# EAGLE schematic ext_tuner_rev1 (EAGLE 7.6.0)

## Sheet 1 of 4
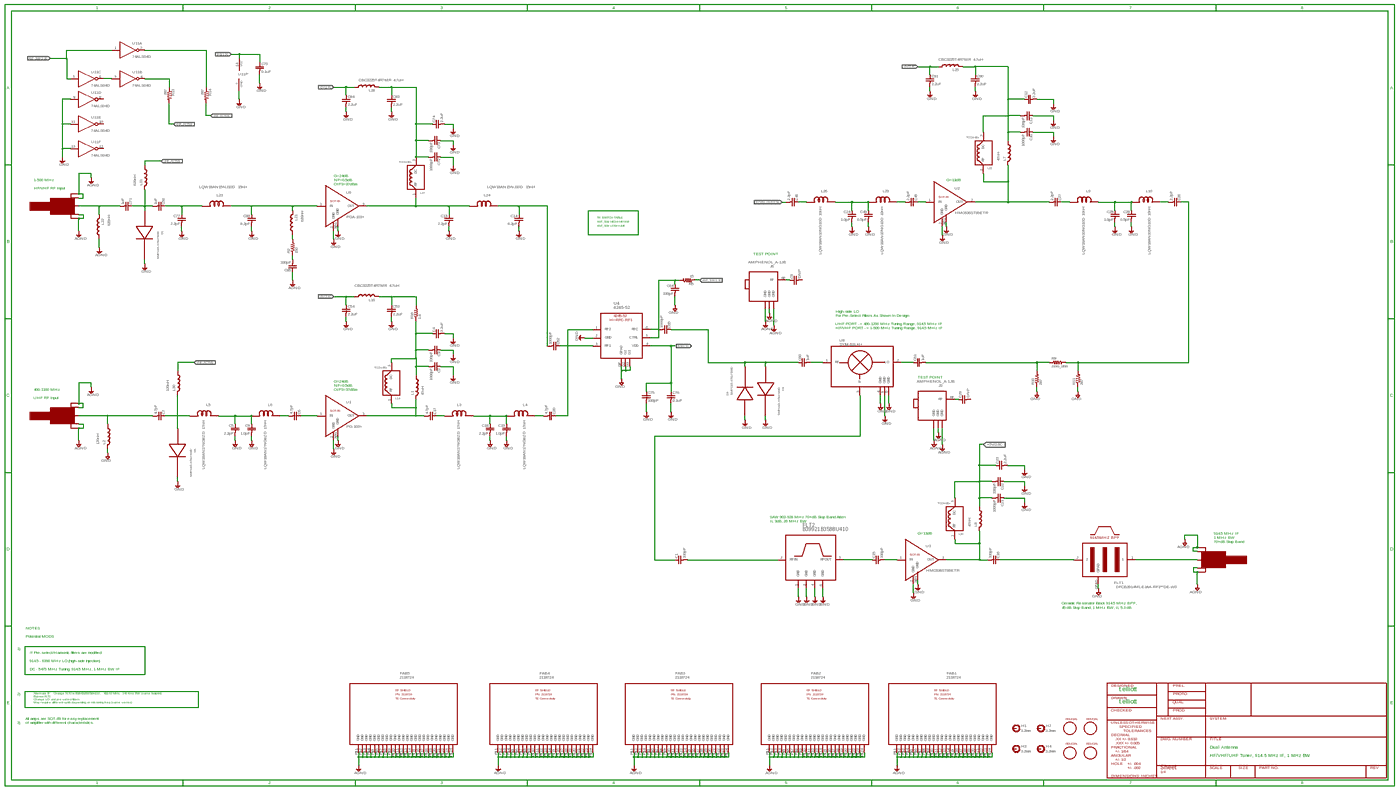
[diagram p0: schematic, sheet 1, overview]
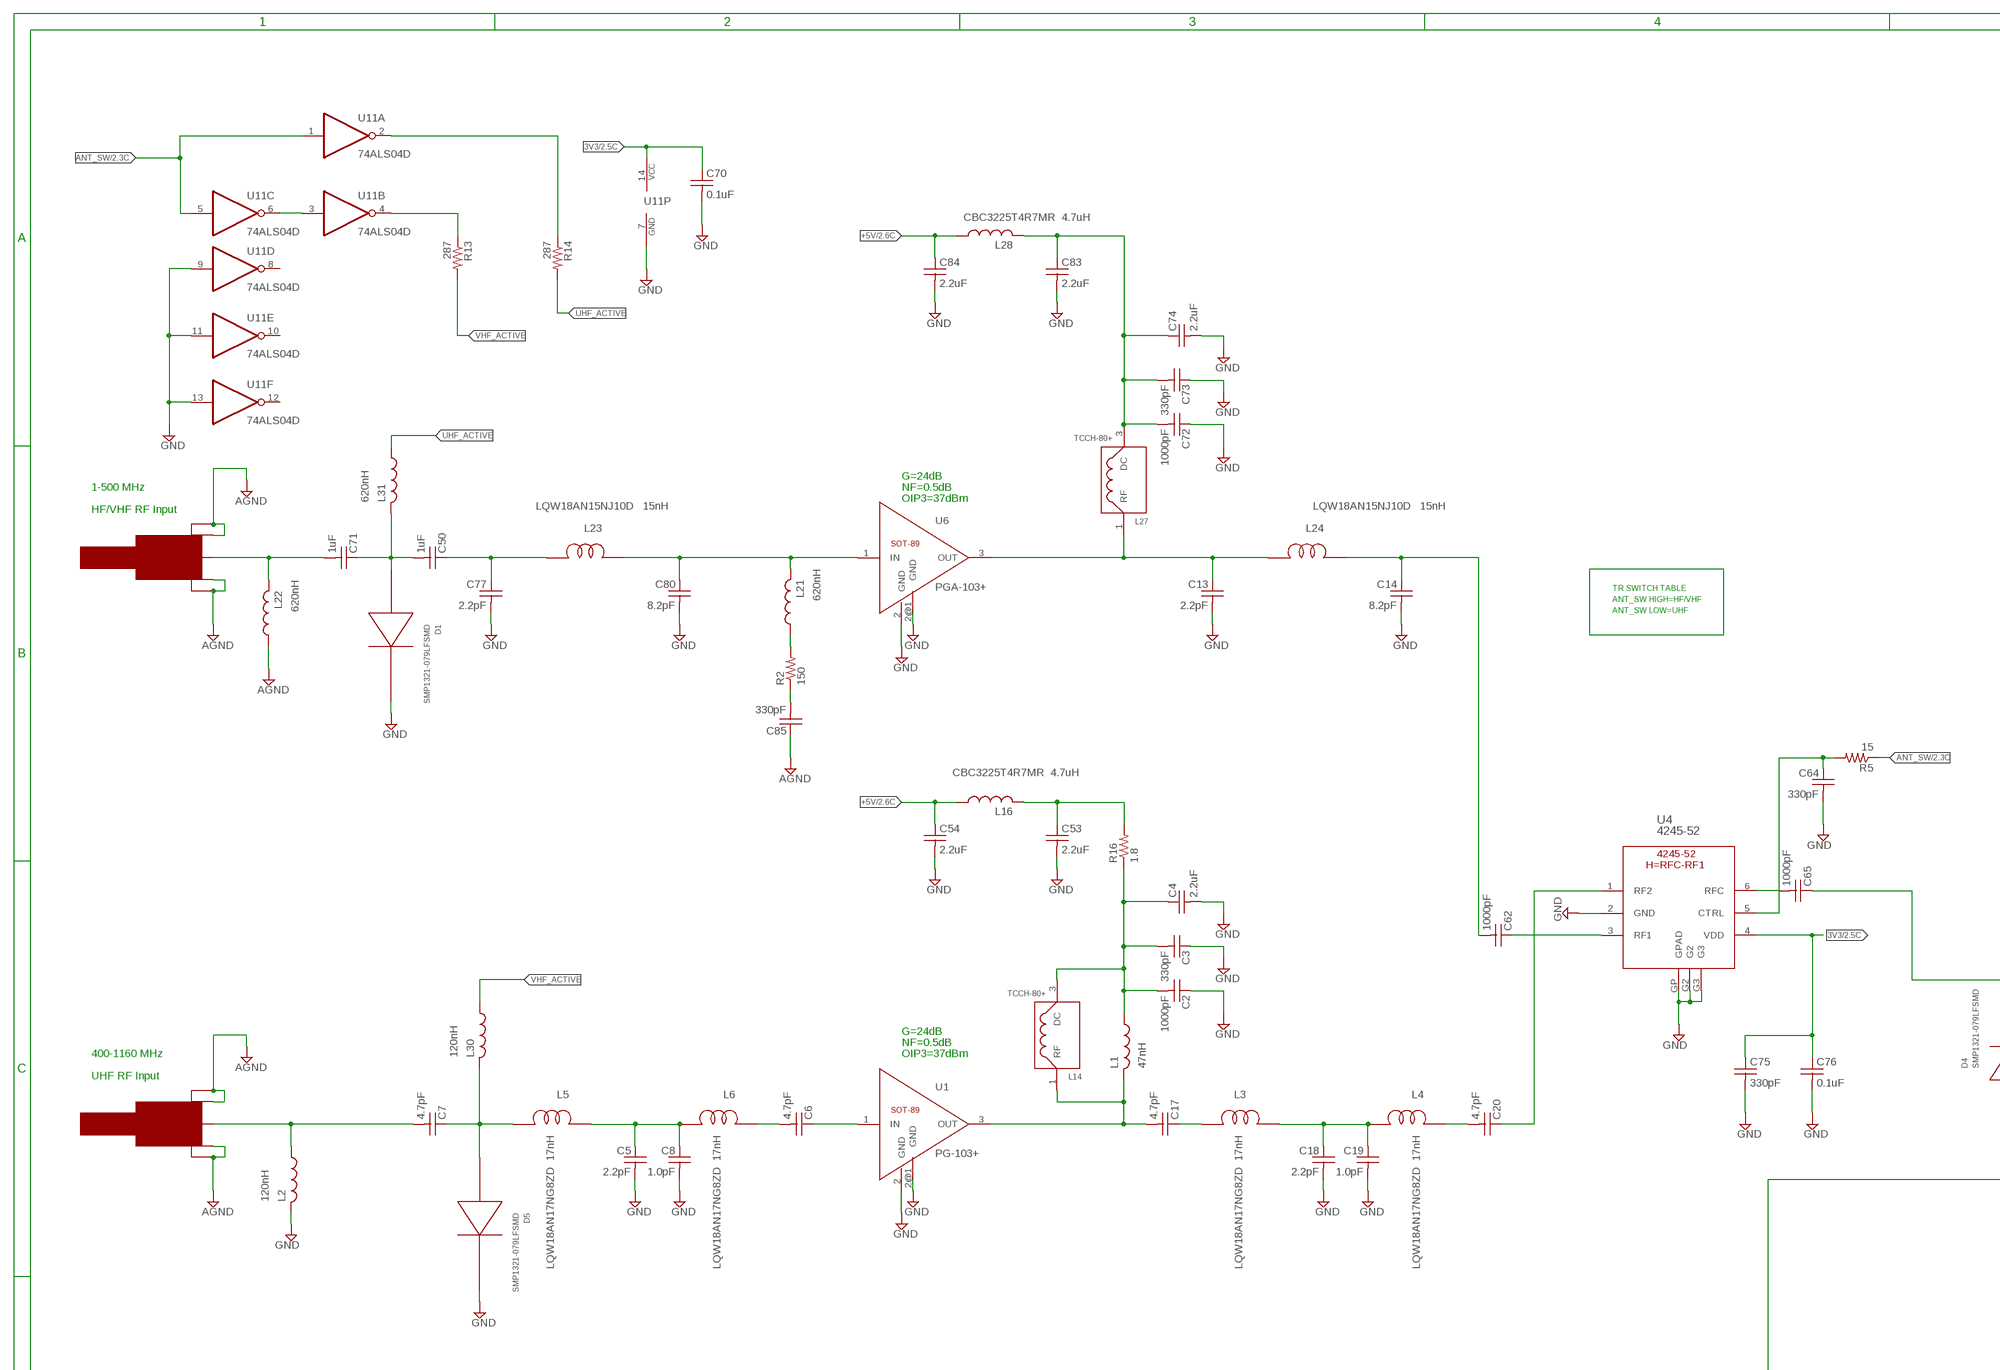
[diagram p1: schematic, sheet 1, part 1 of 4]
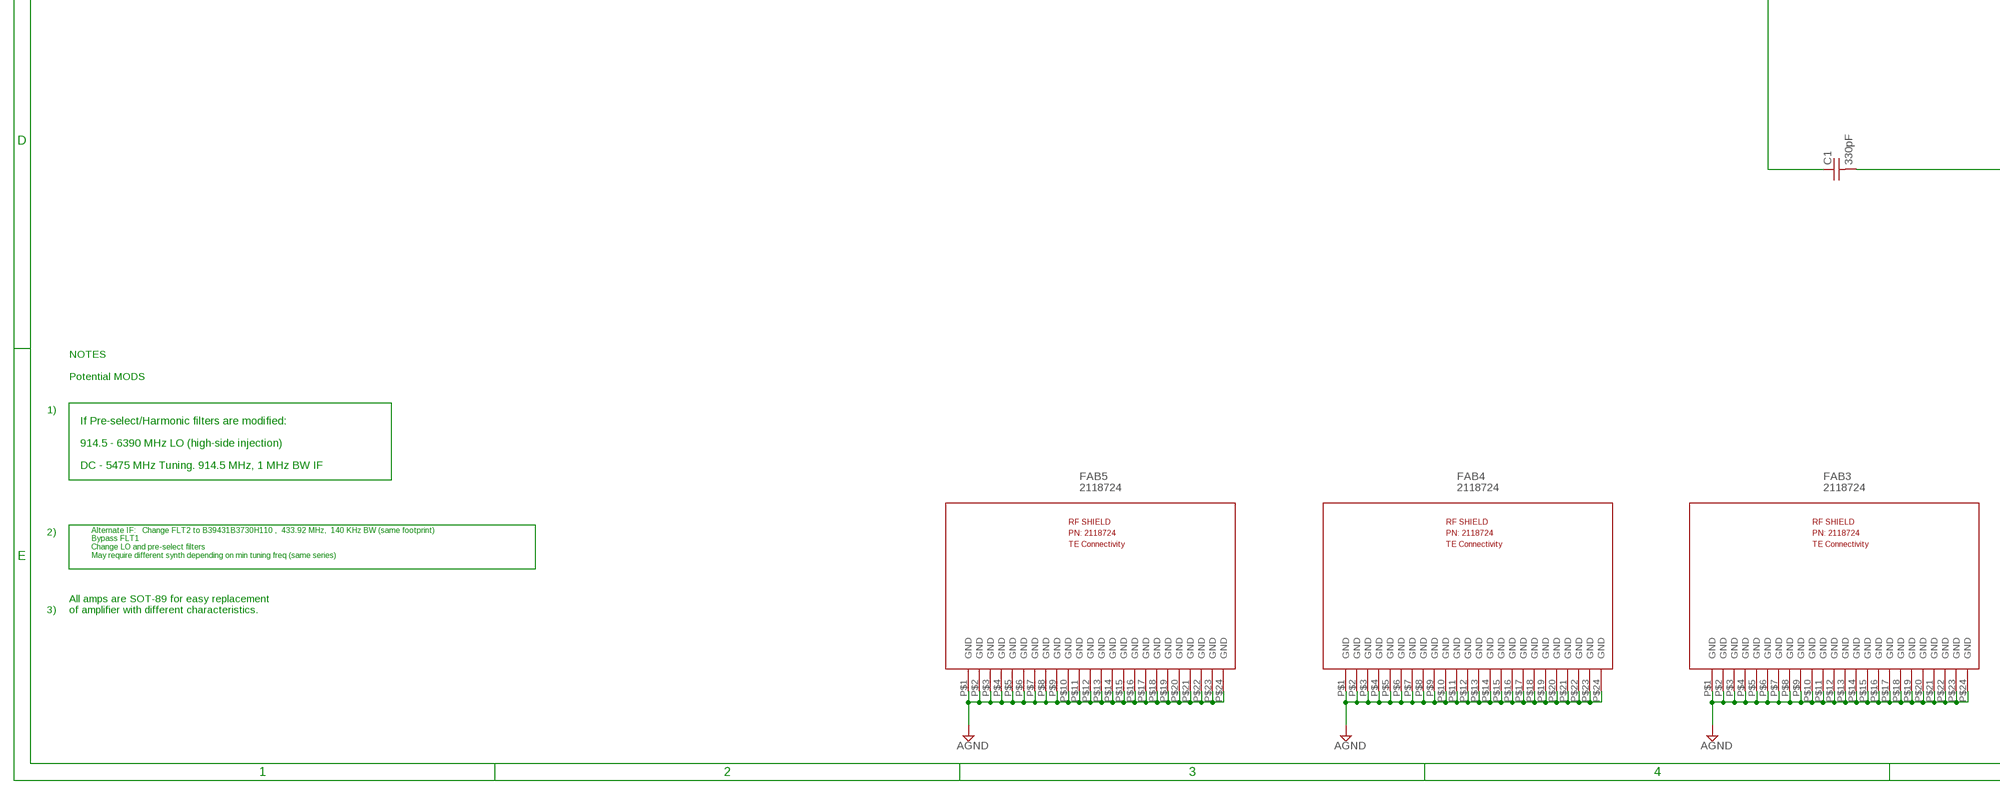
[diagram p2: schematic, sheet 1, part 2 of 4]
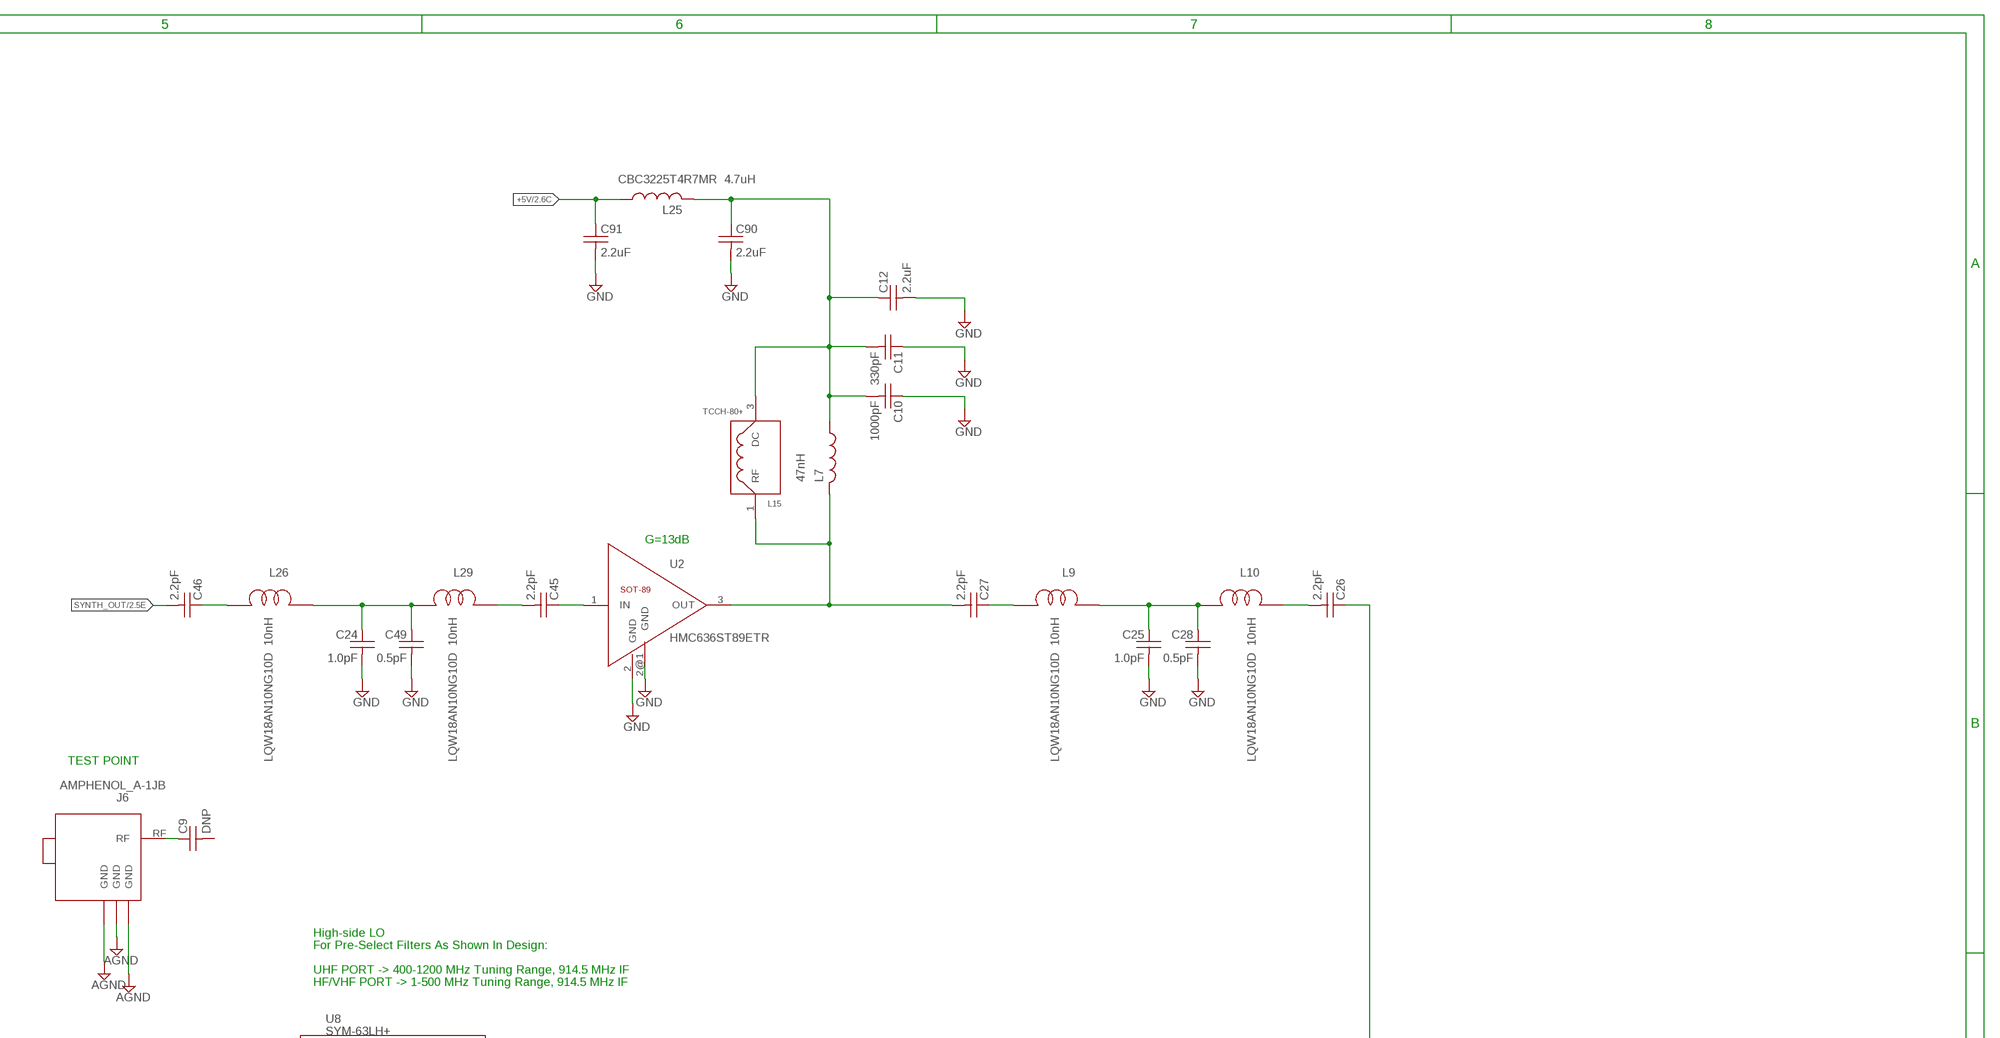
[diagram p3: schematic, sheet 1, part 3 of 4]
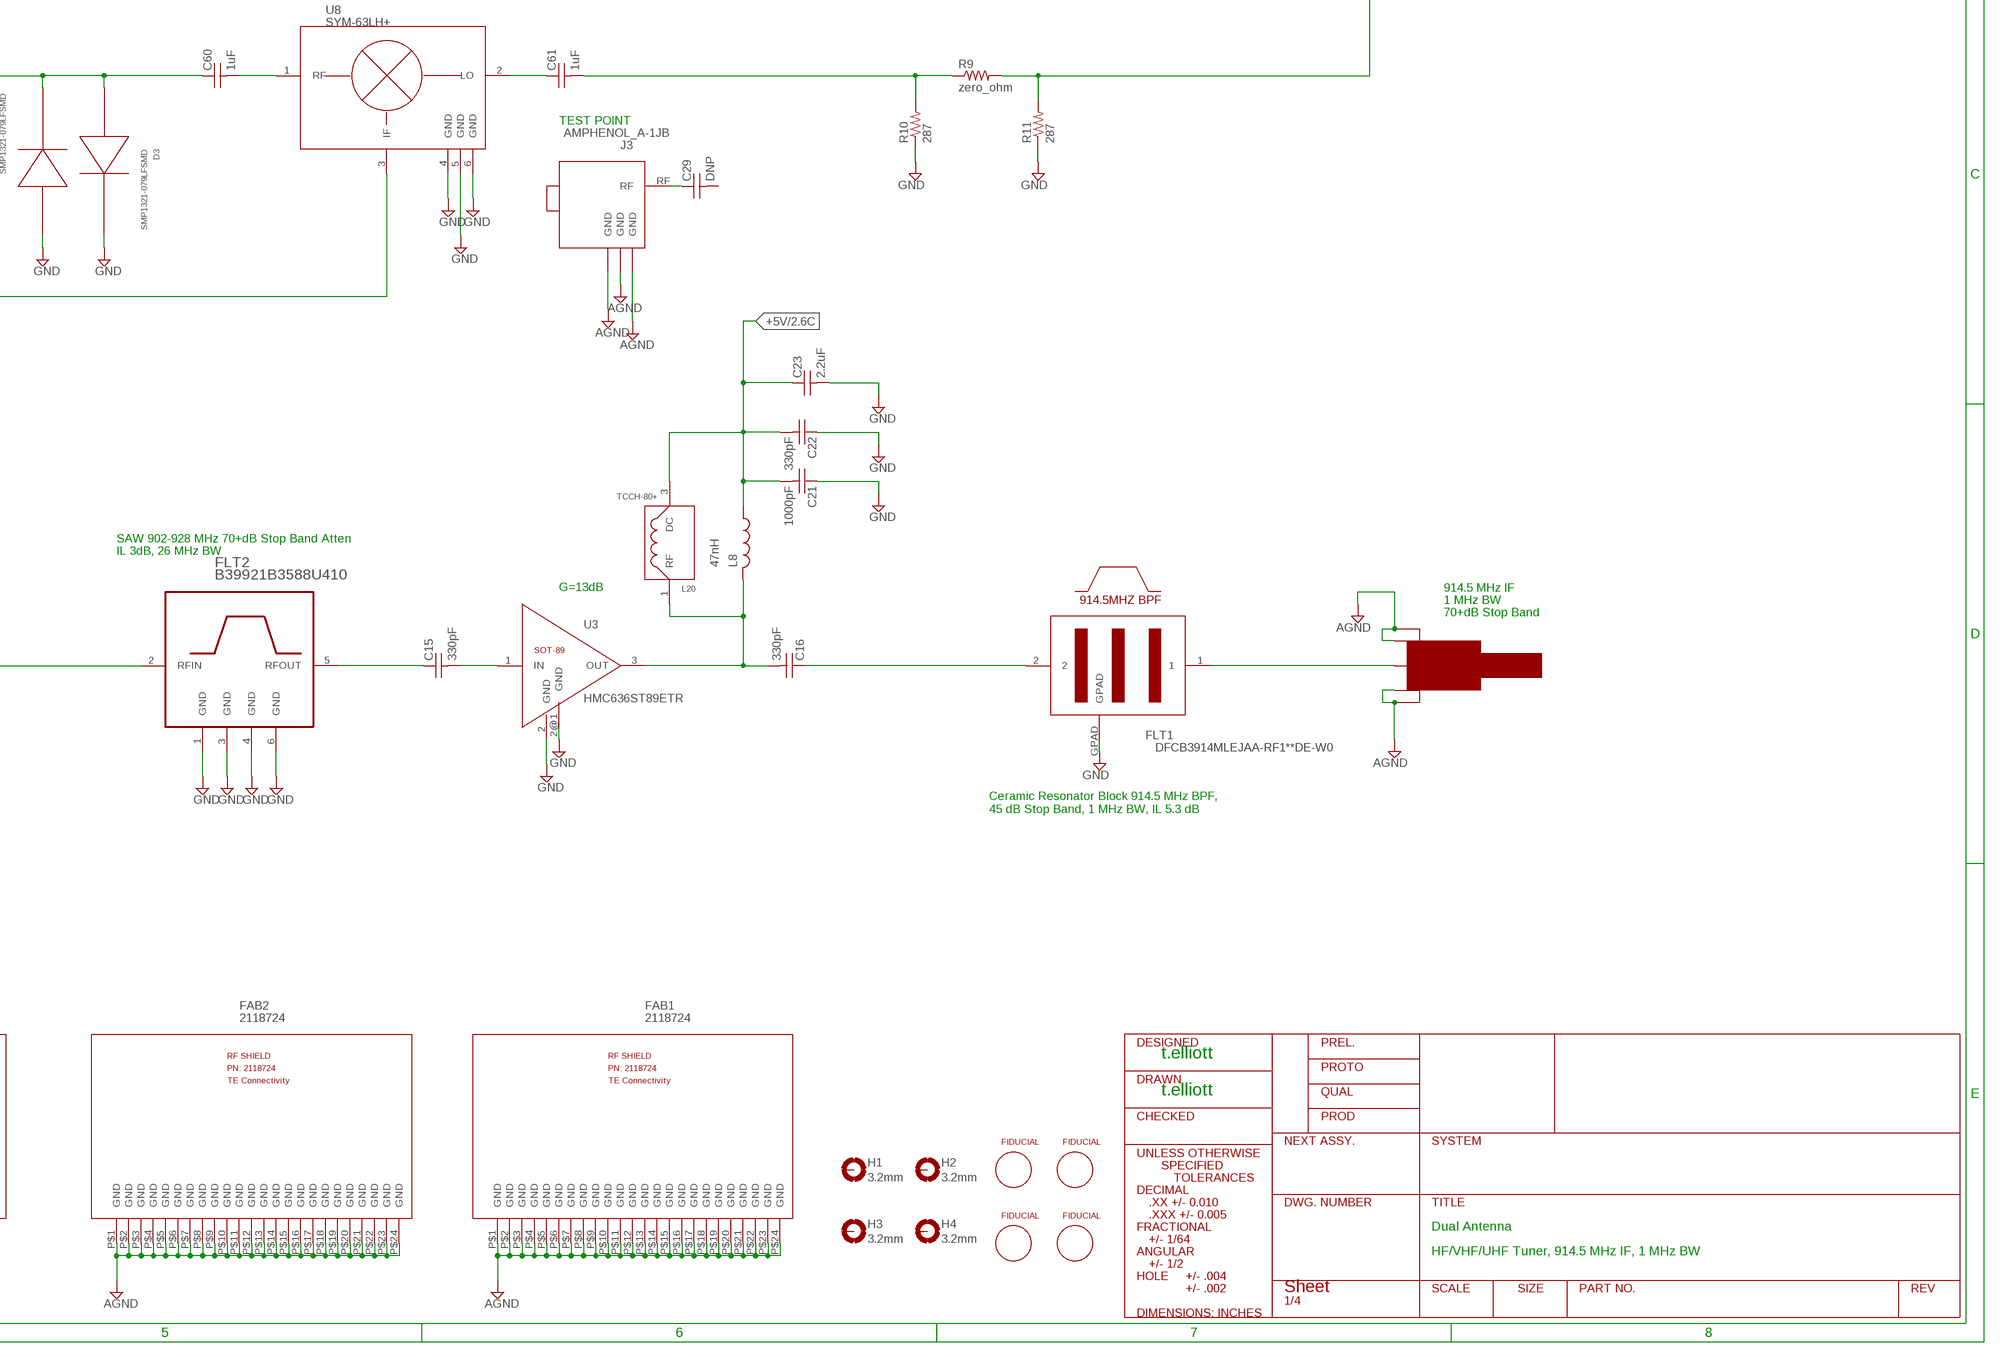
[diagram p4: schematic, sheet 1, part 4 of 4]

### Parts
C1  330pF  C-USC0603  [C0603]
C2  1000pF  C-USC0603  [C0603]
C3  330pF  C-USC0603  [C0603]
C4  2.2uF  C-USC0603  [C0603]
C5  2.2pF  C-USC0603  [C0603]
C6  4.7pF  C-USC0603  [C0603]
C7  4.7pF  C-USC0603  [C0603]
C8  1.0pF  C-USC0603  [C0603]
C9  DNP  C-USC0603  [C0603]
C10  1000pF  C-USC0603  [C0603]
C11  330pF  C-USC0603  [C0603]
C12  2.2uF  C-USC0603  [C0603]
C13  2.2pF  C-USC0603  [C0603]
C14  8.2pF  C-USC0603  [C0603]
C15  330pF  C-USC0603  [C0603]
C16  330pF  C-USC0603  [C0603]
C17  4.7pF  C-USC0603  [C0603]
C18  2.2pF  C-USC0603  [C0603]
C19  1.0pF  C-USC0603  [C0603]
C20  4.7pF  C-USC0603  [C0603]
C21  1000pF  C-USC0603  [C0603]
C22  330pF  C-USC0603  [C0603]
C23  2.2uF  C-USC0603  [C0603]
C24  1.0pF  C-USC0603  [C0603]
C25  1.0pF  C-USC0603  [C0603]
C26  2.2pF  C-USC0603  [C0603]
C27  2.2pF  C-USC0603  [C0603]
C28  0.5pF  C-USC0603  [C0603]
C29  DNP  C-USC0603  [C0603]
C45  2.2pF  C-USC0603  [C0603]
C46  2.2pF  C-USC0603  [C0603]
C49  0.5pF  C-USC0603  [C0603]
C50  1uF  C-USC0603  [C0603]
C53  2.2uF  C-USC0603  [C0603]
C54  2.2uF  C-USC0603  [C0603]
C60  1uF  C-USC0603  [C0603]
C61  1uF  C-USC0603  [C0603]
C62  1000pF  C-USC0603  [C0603]
C64  330pF  C-USC0603  [C0603]
C65  1000pF  C-USC0603  [C0603]
C70  0.1uF  C-USC0402  [C0402@1]
C71  1uF  C-USC0603  [C0603]
C72  1000pF  C-USC0603  [C0603]
C73  330pF  C-USC0603  [C0603]
C74  2.2uF  C-USC0603  [C0603]
C75  330pF  C-USC0603  [C0603]
C76  0.1uF  C-USC0402  [C0402@1]
C77  2.2pF  C-USC0603  [C0603]
C80  8.2pF  C-USC0603  [C0603]
C83  2.2uF  C-USC0603  [C0603]
C84  2.2uF  C-USC0603  [C0603]
C85  330pF  C-USC0603  [C0603]
C90  2.2uF  C-USC0603  [C0603]
C91  2.2uF  C-USC0603  [C0603]
D1  SMP1321-079LFSMD  [SC-79_PINDIODE]
D3  SMP1321-079LFSMD  [SC-79_PINDIODE]
D4  SMP1321-079LFSMD  [SC-79_PINDIODE]
D5  SMP1321-079LFSMD  [SC-79_PINDIODE]
FAB1  2118724  RF_SHIELD_PN_2118724  [RF_SHIELD]
FAB2  2118724  RF_SHIELD_PN_2118724  [RF_SHIELD]
FAB3  2118724  RF_SHIELD_PN_2118724  [RF_SHIELD]
FAB4  2118724  RF_SHIELD_PN_2118724  [RF_SHIELD]
FAB5  2118724  RF_SHIELD_PN_2118724  [RF_SHIELD]
FID1  FIDUCIALSMD  [FIDUCIAL]
FID2  FIDUCIALSMD  [FIDUCIAL]
FID3  FIDUCIALSMD  [FIDUCIAL]
FID4  FIDUCIALSMD  [FIDUCIAL]
FLT1  DFCB3914MLEJAA-RF1**DE-W0  SAW  [SAWMURATA914]
FLT2  B39921B3588U410  SF2049E  [SM3030-6]
H1  3.2mm  MOUNT-PAD-ROUND2.8  [2,8-PAD]
H2  3.2mm  MOUNT-PAD-ROUND2.8  [2,8-PAD]
H3  3.2mm  MOUNT-PAD-ROUND2.8  [2,8-PAD]
H4  3.2mm  MOUNT-PAD-ROUND2.8  [2,8-PAD]
J1  SMA0.062  [SMA_EDGE]
J2  SMA0.062  [SMA_EDGE]
J3  AMPHENOL_A-1JB  [UFLCONNECTOR]
J4  SMA0.062  [SMA_EDGE]
J6  AMPHENOL_A-1JB  [UFLCONNECTOR]
L1  47nH  L-USL3225M  [L3225M]
L2  120nH  L-USL3225M  [L3225M]
L3  LQW18AN17NG8ZD 17nH  COILCRAFT_0806SQ-16N  [MURATA_LQW_0603]
L4  LQW18AN17NG8ZD 17nH  COILCRAFT_0806SQ-16N  [MURATA_LQW_0603]
L5  LQW18AN17NG8ZD 17nH  COILCRAFT_0806SQ-16N  [MURATA_LQW_0603]
L6  LQW18AN17NG8ZD 17nH  COILCRAFT_0806SQ-16N  [MURATA_LQW_0603]
L7  47nH  L-USL3225M  [L3225M]
L8  47nH  L-USL3225M  [L3225M]
L9  LQW18AN10NG10D 10nH  COILCRAFT_0806SQ-16N  [MURATA_LQW_0603]
L10  LQW18AN10NG10D 10nH  COILCRAFT_0806SQ-16N  [MURATA_LQW_0603]
L14  TCCH-80+  TCCH-80+GU1604  [TCCH-80+]
L15  TCCH-80+  TCCH-80+GU1604  [TCCH-80+]
L16  CBC3225T4R7MR 4.7uH  L-USL3225M  [L3225M]
L20  TCCH-80+  TCCH-80+GU1604  [TCCH-80+]
L21  620nH  L-USL3225M  [L3225M]
L22  620nH  L-USL3225M  [L3225M]
L23  LQW18AN15NJ10D 15nH  COILCRAFT_0806SQ-16N  [MURATA_LQW_0603]
L24  LQW18AN15NJ10D 15nH  COILCRAFT_0806SQ-16N  [MURATA_LQW_0603]
L25  CBC3225T4R7MR 4.7uH  L-USL3225M  [L3225M]
L26  LQW18AN10NG10D 10nH  COILCRAFT_0806SQ-16N  [MURATA_LQW_0603]
L27  TCCH-80+  TCCH-80+GU1604  [TCCH-80+]
L28  CBC3225T4R7MR 4.7uH  L-USL3225M  [L3225M]
L29  LQW18AN10NG10D 10nH  COILCRAFT_0806SQ-16N  [MURATA_LQW_0603]
L30  120nH  L-USL3225M  [L3225M]
L31  620nH  L-USL3225M  [L3225M]
R2  150  R-US_R1206  [R1206]
R5  15  RESISTOR0402  [0402$1]
R9  zero_ohm  R-US_R0603  [R0603]
R10  287  R-US_R0603  [R0603]
R11  287  R-US_R0603  [R0603]
R13  287  RESISTOR0603  [0603]
R14  287  RESISTOR0603  [0603]
R16  1.8  R-US_R1206  [R1206]
U1  PG-103+  PGA-103+  [SOT89]
U2  HMC636ST89ETR  PGA-103+  [SOT89]
U3  HMC636ST89ETR  PGA-103+  [SOT89]
U4  4245-52  PE4245  [PE4245]
U6  PGA-103+  [SOT89]
U8  SYM-63LH+  SYM-18H+  [SYM-18H]
U11  74ALS04D  [SO14]

### Nets
3V3: C70.1 C75.1 C76.1 U4.4(VDD) U11.14(P:VCC) ; also sheet 2,3
+5V: C21.2 C22.2 C23.1 C54.1 C84.1 C91.1 L8.1 L16.1 L20.3(DC) L25.1 L28.1 ; also sheet 2
ANT_SW: R5.1 U11.1(A:I) U11.5(C:I) ; also sheet 2,3
GND: C2.1 C3.1 C4.2 C5.2 C8.2 C10.1 C11.1 C12.2 C13.2 C14.2 C18.2 C19.2 C21.1 C22.1 C23.2 C24.2 C25.2 C28.2 C49.2 C53.2 C54.2 C64.2 C70.2 C72.1 C73.1 C74.2 C75.2 C76.2 C77.2 C80.2 C83.2 C84.2 C85.1 C90.2 C91.2 D1.C D3.C D4.A D5.C FAB1.P$1(GND) FAB1.P$2(GND) FAB1.P$3(GND) FAB1.P$4(GND) FAB1.P$5(GND) FAB1.P$6(GND) FAB1.P$7(GND) FAB1.P$8(GND) FAB1.P$9(GND) FAB1.P$10(GND) FAB1.P$11(GND) FAB1.P$12(GND) FAB1.P$13(GND) FAB1.P$14(GND) FAB1.P$15(GND) FAB1.P$16(GND) FAB1.P$17(GND) FAB1.P$18(GND) FAB1.P$19(GND) FAB1.P$20(GND) FAB1.P$21(GND) FAB1.P$22(GND) FAB1.P$23(GND) FAB1.P$24(GND) FAB2.P$1(GND) FAB2.P$2(GND) FAB2.P$3(GND) FAB2.P$4(GND) FAB2.P$5(GND) FAB2.P$6(GND) FAB2.P$7(GND) FAB2.P$8(GND) FAB2.P$9(GND) FAB2.P$10(GND) FAB2.P$11(GND) FAB2.P$12(GND) FAB2.P$13(GND) FAB2.P$14(GND) FAB2.P$15(GND) FAB2.P$16(GND) FAB2.P$17(GND) FAB2.P$18(GND) FAB2.P$19(GND) FAB2.P$20(GND) FAB2.P$21(GND) FAB2.P$22(GND) FAB2.P$23(GND) FAB2.P$24(GND) FAB3.P$1(GND) FAB3.P$2(GND) FAB3.P$3(GND) FAB3.P$4(GND) FAB3.P$5(GND) FAB3.P$6(GND) FAB3.P$7(GND) FAB3.P$8(GND) FAB3.P$9(GND) FAB3.P$10(GND) FAB3.P$11(GND) FAB3.P$12(GND) FAB3.P$13(GND) FAB3.P$14(GND) FAB3.P$15(GND) FAB3.P$16(GND) FAB3.P$17(GND) FAB3.P$18(GND) FAB3.P$19(GND) FAB3.P$20(GND) FAB3.P$21(GND) FAB3.P$22(GND) FAB3.P$23(GND) FAB3.P$24(GND) FAB4.P$1(GND) FAB4.P$2(GND) FAB4.P$3(GND) FAB4.P$4(GND) FAB4.P$5(GND) FAB4.P$6(GND) FAB4.P$7(GND) FAB4.P$8(GND) FAB4.P$9(GND) FAB4.P$10(GND) FAB4.P$11(GND) FAB4.P$12(GND) FAB4.P$13(GND) FAB4.P$14(GND) FAB4.P$15(GND) FAB4.P$16(GND) FAB4.P$17(GND) FAB4.P$18(GND) FAB4.P$19(GND) FAB4.P$20(GND) FAB4.P$21(GND) FAB4.P$22(GND) FAB4.P$23(GND) FAB4.P$24(GND) FAB5.P$1(GND) FAB5.P$2(GND) FAB5.P$3(GND) FAB5.P$4(GND) FAB5.P$5(GND) FAB5.P$6(GND) FAB5.P$7(GND) FAB5.P$8(GND) FAB5.P$9(GND) FAB5.P$10(GND) FAB5.P$11(GND) FAB5.P$12(GND) FAB5.P$13(GND) FAB5.P$14(GND) FAB5.P$15(GND) FAB5.P$16(GND) FAB5.P$17(GND) FAB5.P$18(GND) FAB5.P$19(GND) FAB5.P$20(GND) FAB5.P$21(GND) FAB5.P$22(GND) FAB5.P$23(GND) FAB5.P$24(GND) FLT1.GPAD FLT2.1(GND) FLT2.3(GND) FLT2.4(GND) FLT2.6(GND) J1.GND1 J1.GND2(GND3) J1.GND3(GND2) J1.GND4 J2.GND1 J2.GND2(GND3) J2.GND3(GND2) J2.GND4 J3.1(GND) J3.2(GND) J3.3(GND) J4.GND1 J4.GND2(GND3) J4.GND3(GND2) J4.GND4 J6.1(GND) J6.2(GND) J6.3(GND) L2.2 L22.1 R10.1 R11.1 U1.2(GND) U1.2@1(GND) U2.2(GND) U2.2@1(GND) U3.2(GND) U3.2@1(GND) U4.2(GND) U4.G2 U4.G3 U4.GP(GPAD) U6.2(GND) U6.2@1(GND) U8.4(GND) U8.5(GND) U8.6(GND) U11.7(P:GND) U11.9(D:I) U11.11(E:I) U11.13(F:I) ; supply symbol labelled AGND ; also sheet 2,3
N$1: C15.2 U3.1(IN)
N$2: C17.2 L1.2 L14.1(RF) U1.3(OUT)
N$3: C1.2 FLT2.2(RFIN)
N$4: C62.1 U4.3(RF1)
N$5: C16.1 FLT1.2
N$6: C6.1 U1.1(IN)
N$7: C9.1 J6.RF
N$8: C7.1 D5.A L5.1 L30.2
N$9: C46.1 L26.1
N$11: C5.1 C8.1 L5.2 L6.1
N$12: C6.2 L6.2
N$13: C1.1 U8.3(IF)
N$14: C60.1 C65.1 D3.A D4.C
N$15: C61.2 R9.1 R10.2
N$16: C26.1 R9.2 R11.2
N$17: C17.1 L3.1
N$18: C27.2 L7.2 L15.1(RF) U2.3(OUT)
N$19: C16.2 L8.2 L20.1(RF) U3.3(OUT)
N$20: C20.1 U4.1(RF2)
N$21: C18.1 C19.1 L3.2 L4.1
N$22: C20.2 L4.2
N$23: C64.1 R5.2 U4.5(CTRL)
N$24: C15.1 FLT2.5(RFOUT)
N$25: FLT1.1 J2.RF
N$26: C27.1 L9.1
N$27: C25.1 C28.1 L9.2 L10.1
N$28: C26.2 L10.2
N$29: C50.2 C71.1 D1.A L31.2
N$30: C85.2 R2.1
N$32: C29.1 J3.RF
N$50: C53.1 L16.2 R16.2
N$60: C72.2 C73.2 C74.1 C83.1 L27.3(DC) L28.2
N$61: C61.1 U8.2(LO)
N$62: C65.2 U4.6(RFC)
N$63: C13.1 L24.1 L27.1(RF) U6.3(OUT)
N$69: L21.1 R2.2
N$70: C80.1 L21.2 L23.2 U6.1(IN)
N$71: C71.2 J4.RF L22.2
N$72: C24.1 C49.1 L26.2 L29.1
N$74: C14.1 C62.2 L24.2
N$81: C60.2 U8.1(RF)
N$83: C45.2 L29.2
N$84: C2.2 C3.2 C4.1 L1.1 L14.3(DC) R16.1
N$85: C45.1 U2.1(IN)
N$86: C50.1 C77.1 L23.1
N$91: R13.1 U11.4(B:O)
N$92: R14.1 U11.2(A:O)
N$93: U11.3(B:I) U11.6(C:O)
N$999: C10.2 C11.2 C12.1 C90.1 L7.1 L15.3(DC) L25.2
SYNTH_OUT: C46.2 ; also sheet 2
UHF_ACTIVE: L31.1 R14.2
UHF_IN: C7.2 J1.RF L2.1
VHF_ACTIVE: L30.1 R13.2
Unconnected: C9.2 C29.2 H1.B2,8(MOUNT) H2.B2,8(MOUNT) H3.B2,8(MOUNT) H4.B2,8(MOUNT) U11.8(D:O) U11.10(E:O) U11.12(F:O)

### Notes on the sheet
- G=24dB
- 1-500 MHz | NF=0.5dB | G=13dB
- OIP3=37dBm
- HF/VHF RF Input
- TR SWITCH TABLE
- ANT_SW HIGH=HF/VHF
- ANT_SW LOW=UHF
- TEST POINT
- High-side LO
- For Pre-Select Filters As Shown In Design:
- UHF PORT -> 400-1200 MHz Tuning Range, 914.5 MHz IF
- HF/VHF PORT -> 1-500 MHz Tuning Range, 914.5 MHz IF
- TEST POINT
- G=24dB
- NF=0.5dB
- 400-1160 MHz | OIP3=37dBm
- UHF RF Input
- SAW 902-928 MHz 70+dB Stop Band Atten
- IL 3dB, 26 MHz BW
- 914.5 MHz IF
- G=13dB | 1 MHz BW
- 70+dB Stop Band
- Ceramic Resonator Block 914.5 MHz BPF,
  45 dB Stop Band, 1 MHz BW, IL 5.3 dB
- NOTES
- Potential MODS
- 1)
- If Pre-select/Harmonic filters are modified:
- 914.5 - 6390 MHz LO (high-side injection)
- DC - 5475 MHz Tuning. 914.5 MHz, 1 MHz BW IF
- t.elliott
- 2)
- Alternate IF:   Change FLT2 to B39431B3730H110 ,  433.92 MHz,  140 KHz BW (same footprint)
  Bypass FLT1 
  Change LO and pre-select filters
  May require different synth depending on min tuning freq (same series)
- t.elliott
- 3)
- All amps are SOT-89 for easy replacement
  of amplifier with different characteristics.
- Dual Antenna
- HF/VHF/UHF Tuner, 914.5 MHz IF, 1 MHz BW

## Sheet 2 of 4
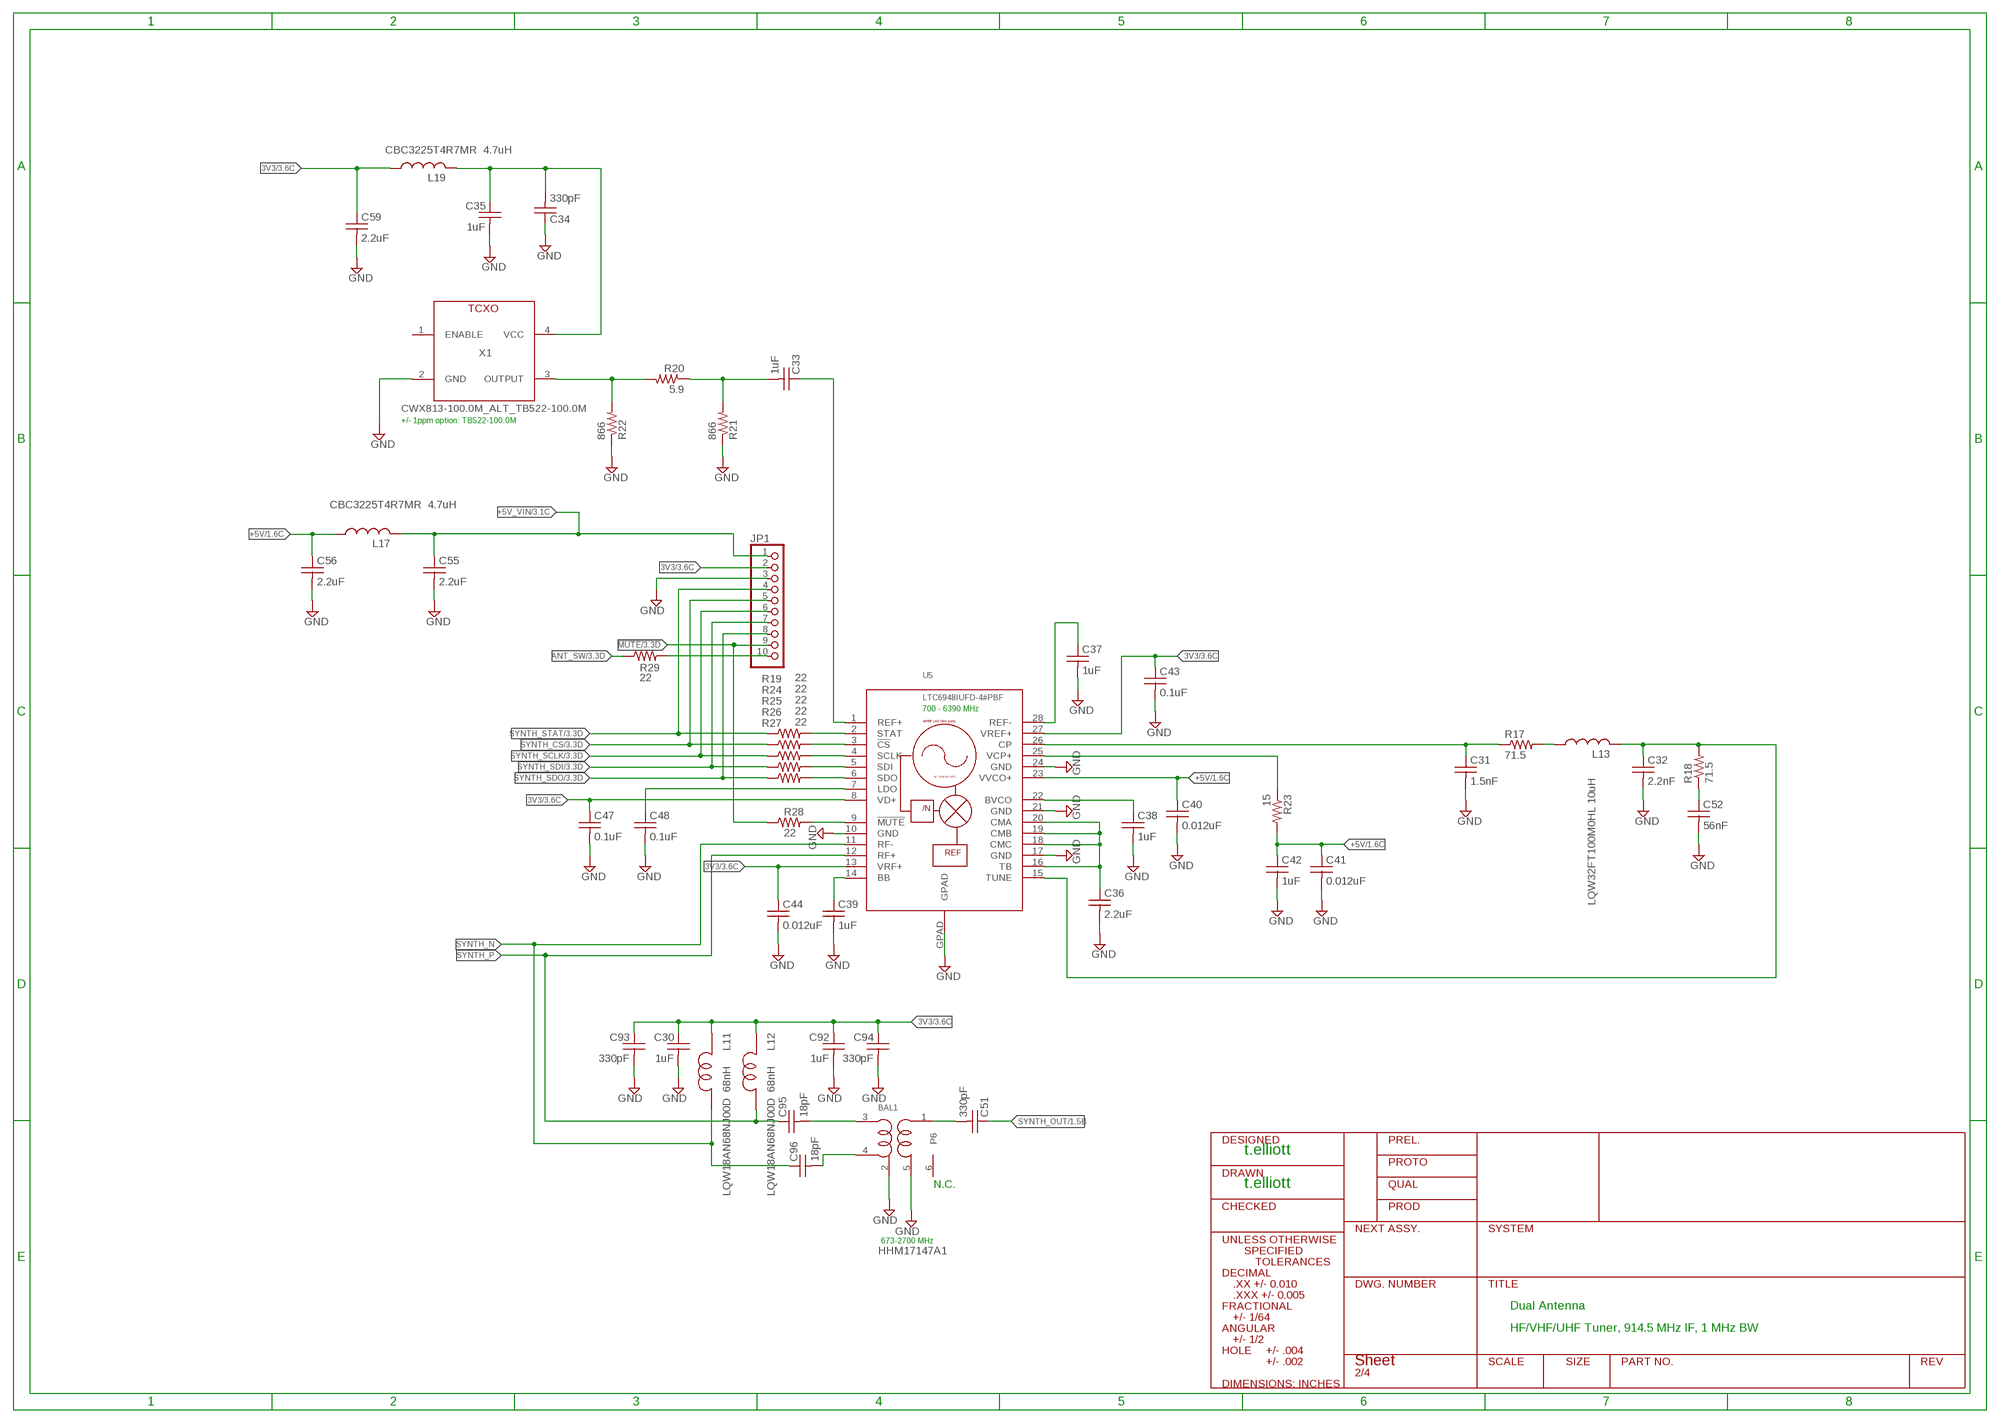
[diagram p5: schematic, sheet 2]

### Parts
BAL1  HHM17147A1  BALUN_TDK_HHM1522B1B  [TDK_BALUN_5PIN]
C30  1uF  C-USC0603  [C0603]
C31  1.5nF  C-USC0402  [C0402@1]
C32  2.2nF  C-USC0402  [C0402@1]
C33  1uF  C-USC0603  [C0603]
C34  330pF  C-USC0603  [C0603]
C35  1uF  C-USC0603  [C0603]
C36  2.2uF  C-USC0603  [C0603]
C37  1uF  C-USC0402  [C0402@1]
C38  1uF  C-USC0402  [C0402@1]
C39  1uF  C-USC0402  [C0402@1]
C40  0.012uF  C-USC0402  [C0402@1]
C41  0.012uF  C-USC0402  [C0402@1]
C42  1uF  C-USC0402  [C0402@1]
C43  0.1uF  C-USC0402  [C0402@1]
C44  0.012uF  C-USC0402  [C0402@1]
C47  0.1uF  C-USC0402  [C0402@1]
C48  0.1uF  C-USC0402  [C0402@1]
C51  330pF  C-USC0603  [C0603]
C52  56nF  C-USC0402  [C0402@1]
C55  2.2uF  C-USC0603  [C0603]
C56  2.2uF  C-USC0603  [C0603]
C59  2.2uF  C-USC0603  [C0603]
C92  1uF  C-USC0603  [C0603]
C93  330pF  C-USC0603  [C0603]
C94  330pF  C-USC0603  [C0603]
C95  18pF  C-USC0402  [C0402@1]
C96  18pF  C-USC0402  [C0402@1]
JP1  PINHD-1X10  [1X10]
L11  LQW18AN68NJ00D 68nH  COILCRAFT_0806SQ-16N  [MURATA_LQW_0603]
L12  LQW18AN68NJ00D 68nH  COILCRAFT_0806SQ-16N  [MURATA_LQW_0603]
L13  LQW32FT100M0HL 10uH  L-USL3225M  [L3225M]
L17  CBC3225T4R7MR 4.7uH  L-USL3225M  [L3225M]
L19  CBC3225T4R7MR 4.7uH  L-USL3225M  [L3225M]
R17  71.5  R-US_R0402  [R0402]
R18  71.5  R-US_R0402  [R0402]
R19  22  R-US_R0402  [R0603_COMPACT]
R20  5.9  R-US_R0603  [R0603]
R21  866  R-US_R0603  [R0603]
R22  866  R-US_R0603  [R0603]
R23  15  R-US_R0402  [R0402]
R24  22  R-US_R0402  [R0603_COMPACT]
R25  22  R-US_R0402  [R0603_COMPACT]
R26  22  R-US_R0402  [R0603_COMPACT]
R27  22  R-US_R0402  [R0603_COMPACT]
R28  22  R-US_R0402  [R0603_COMPACT]
R29  22  R-US_R0402  [R0603_COMPACT]
U5  LTC6948IUFD-4#PBF  LTC6948QFN28  [QFN28_NONSQ]
X1  CWX813-100.0M_ALT_TB522-100.0M  CWX813-020.0M  [CWX8XX_5MM_7MM]

### Nets
3V3: C30.1 C43.1 C44.1 C47.1 C59.1 C92.1 C93.1 C94.1 JP1.2 L11.2 L12.2 L19.1 U5.8(VD+) U5.13(VRF+) U5.27(VREF+) ; also sheet 1,3
!MUTE: JP1.9 R28.1 ; also sheet 3
+5V: C40.1 C41.1 C42.1 C56.1 L17.1 R23.2 U5.23(VVCO+) ; also sheet 1
+5V_VIN: C55.1 JP1.1 L17.2 ; also sheet 3
ANT_SW: R29.1 ; also sheet 1,3
BALUN_N [differential]: BAL1.4(BP1) C96.2
BALUN_P [differential]: BAL1.3(BP2) C95.2
GND: BAL1.2(FEED) BAL1.5(GND) C30.2 C31.2 C32.2 C34.1 C35.2 C36.2 C37.2 C38.2 C39.2 C40.2 C41.2 C42.2 C43.2 C44.2 C47.2 C48.2 C52.2 C55.2 C56.2 C59.2 C92.2 C93.2 C94.2 JP1.3 R21.1 R22.1 U5.10(GND) U5.17(GND) U5.21(GND) U5.24(GND) U5.GPAD X1.2(GND) ; also sheet 1,3
N$31: R19.2 U5.2(STAT)
N$33: C52.1 R18.1
N$34: C32.1 L13.2 R18.2 U5.15(TUNE)
N$35: L13.1 R17.2
N$36: R24.2 U5.3(!CS)
N$37: R25.2 U5.4(SCLK)
N$38: R26.2 U5.5(SDI)
N$39: R27.2 U5.6(SDO)
N$40: C36.1 U5.16(TB) U5.18(CMC) U5.19(CMB) U5.20(CMA)
N$41: R20.2 R22.2 X1.3(OUTPUT)
N$42: C33.1 U5.1(REF+)
N$43: C33.2 R20.1 R21.2
N$44: C37.1 U5.28(REF-)
N$45: C38.1 U5.22(BVCO)
N$46: C39.1 U5.14(BB)
N$47: R23.1 U5.25(VCP+)
N$48: C48.1 U5.7(LDO)
N$49: R28.2 U5.9(!MUTE)
N$51: C31.1 R17.1 U5.26(CP)
N$56: BAL1.1(UBAL) C51.2
N$57: JP1.10 R29.2
N$59: C34.2 C35.1 L19.2 X1.4(VCC)
SYNTH_CS: JP1.5 R24.1 ; also sheet 3
SYNTH_N [differential]: C96.1 L11.1 U5.11(RF-)
SYNTH_OUT: C51.1 ; also sheet 1
SYNTH_P [differential]: C95.1 L12.1 U5.12(RF+)
SYNTH_SCLK: JP1.6 R25.1 ; also sheet 3
SYNTH_SDI: JP1.7 R26.1 ; also sheet 3
SYNTH_SDO: JP1.8 R27.1 ; also sheet 3
SYNTH_STAT: JP1.4 R19.1 ; also sheet 3
Unconnected: BAL1.6 X1.1(ENABLE)

### Notes on the sheet
- +/- 1ppm option: TB522-100.0M
- 700 - 6390 MHz
- t.elliott
- N.C. | t.elliott
- 673-2700 MHz
- Dual Antenna
- HF/VHF/UHF Tuner, 914.5 MHz IF, 1 MHz BW

## Sheet 3 of 4
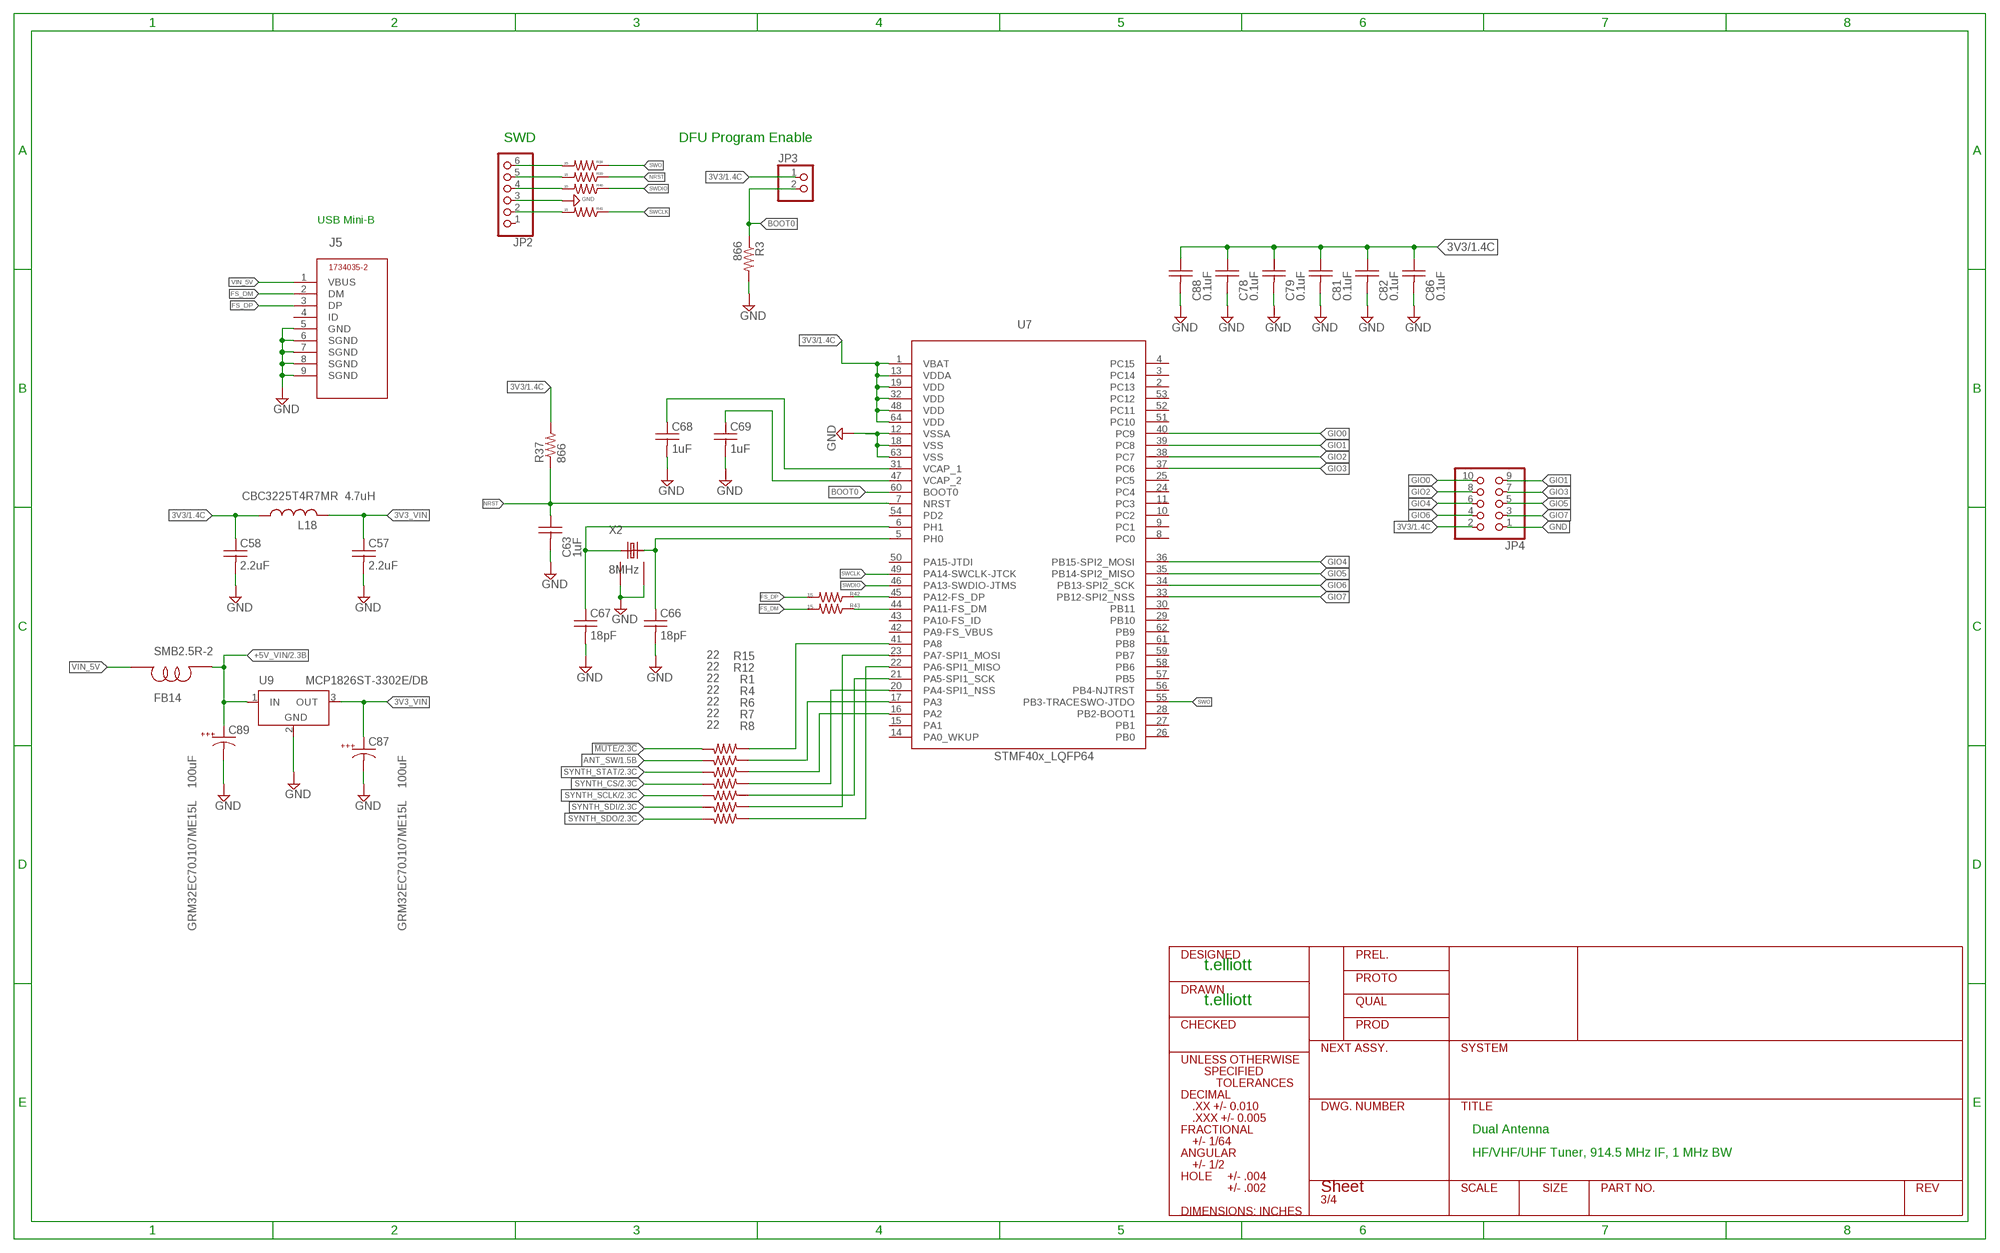
[diagram p6: schematic, sheet 3]

### Parts
C57  2.2uF  C-USC0603  [C0603]
C58  2.2uF  C-USC0603  [C0603]
C63  1uF  C-USC0402  [C0402@1]
C66  18pF  C-USC0402  [C0402@1]
C67  18pF  C-USC0402  [C0402@1]
C68  1uF  C-USC0402  [C0402@1]
C69  1uF  C-USC0402  [C0402@1]
C78  0.1uF  C-USC0402  [C0402@1]
C79  0.1uF  C-USC0402  [C0402@1]
C81  0.1uF  C-USC0402  [C0402@1]
C82  0.1uF  C-USC0402  [C0402@1]
C86  0.1uF  C-USC0402  [C0402@1]
C87  GRM32EC70J107ME15L 100uF  CAPACITOR1210K  [1210K]
C88  0.1uF  C-USC0402  [C0402@1]
C89  GRM32EC70J107ME15L 100uF  CAPACITOR1210K  [1210K]
FB14  SMB2.5R-2  SMB2.5  [SMB2.5-2]
J5  1734035-2  [1734035-2]
JP2  PINHD-1X6  [1X06]
JP3  PINHD-1X2  [1X02]
JP4  PINHD-2X5  [2X05]
L18  CBC3225T4R7MR 4.7uH  L-USL3225M  [L3225M]
R1  22  R-US_R0402  [R0603_COMPACT]
R3  866  R-US_R0603  [R0603]
R4  22  R-US_R0402  [R0603_COMPACT]
R6  22  R-US_R0402  [R0603_COMPACT]
R7  22  R-US_R0402  [R0603_COMPACT]
R8  22  R-US_R0402  [R0603_COMPACT]
R12  22  R-US_R0402  [R0603_COMPACT]
R15  22  R-US_R0402  [R0603_COMPACT]
R37  866  RESISTOR0603  [0603]
R38  15  RESISTOR0402  [0402$1]
R39  15  RESISTOR0402  [0402$1]
R40  15  RESISTOR0402  [0402$1]
R41  15  RESISTOR0402  [0402$1]
R42  15  RESISTOR0402  [0402$1]
R43  15  RESISTOR0402  [0402$1]
U7  STM32_STM32F40X_LQFP64RGT6  [STM32_LQFP64]
U9  MCP1826ST-3302E/DB  LT1129CST5  [SOT223]
X2  8MHz  ECS_CRYSTAL_ECS-250-20-30B-DUDU  [ECS_CRYSTAL_ECS-250-20-30B-DU_CRYSTAL]

### Nets
3V3: C58.1 C78.1 C79.1 C81.1 C82.1 C86.1 C88.1 JP3.1 JP4.2 L18.1 R37.2 U7.1(VBAT) U7.13(VDDA) U7.19(VDD) U7.32(VDD) U7.48(VDD) U7.64(VDD) ; also sheet 1,2
3V3_VIN: C57.1 C87.A L18.2 U9.3(OUT)
!MUTE: R15.2 ; also sheet 2
+5V_VIN: C89.A FB14.P$1 U9.1(IN) ; also sheet 2
ANT_SW: R12.2 ; also sheet 1,2
BOOT0: JP3.2 R3.1 U7.60(BOOT0)
FS_DM: J5.2(DM) R43.2
FS_DP: J5.3(DP) R42.2
GIO0: JP4.10 U7.40(PC9)
GIO1: JP4.9 U7.39(PC8)
GIO2: JP4.8 U7.38(PC7)
GIO3: JP4.7 U7.37(PC6)
GIO4: JP4.6 U7.36(PB15-SPI2_MOSI)
GIO5: JP4.5 U7.35(PB14-SPI2_MISO)
GIO6: JP4.4 U7.34(PB13-SPI2_SCK)
GIO7: JP4.3 U7.33(PB12-SPI2_NSS)
GND: C57.2 C58.2 C63.2 C66.2 C67.2 C68.2 C69.2 C78.2 C79.2 C81.2 C82.2 C86.2 C87.C C88.2 C89.C J5.5(GND) J5.6(SGND) J5.7(SGND) J5.8(SGND) J5.9(SGND) JP2.3 JP4.1 R3.2 U7.12(VSSA) U7.18(VSS) U7.63(VSS) U9.2(GND) X2.GND@1(GND) X2.GND@2(GND) ; also sheet 1,2
N$52 [differential]: R6.1 U7.21(PA5-SPI1_SCK)
N$53 [differential]: R8.1 U7.22(PA6-SPI1_MISO)
N$54 [differential]: R7.1 U7.23(PA7-SPI1_MOSI)
N$55 [differential]: R4.1 U7.20(PA4-SPI1_NSS)
N$64: C67.1 U7.6(PH1) X2.1
N$65: C66.1 U7.5(PH0) X2.3
N$66: R42.1 U7.45(PA12-FS_DP)
N$67: R43.1 U7.44(PA11-FS_DM)
N$68: C69.1 U7.47(VCAP_2)
N$73: C68.1 U7.31(VCAP_1)
N$75: JP2.6 R38.2
N$76: JP2.5 R39.2
N$77: JP2.4 R40.2
N$78: JP2.2 R41.2
N$79 [differential]: R1.1 U7.16(PA2)
N$80 [differential]: R12.1 U7.17(PA3)
N$87: R15.1 U7.41(PA8)
NRST: C63.1 R37.1 R39.1 U7.7(NRST)
SWCLK: R41.1 U7.49(PA14-SWCLK-JTCK)
SWDIO: R40.1 U7.46(PA13-SWDIO-JTMS)
SWO: R38.1 U7.55(PB3-TRACESWO-JTDO)
SYNTH_CS: R4.2 ; also sheet 2
SYNTH_SCLK: R6.2 ; also sheet 2
SYNTH_SDI: R7.2 ; also sheet 2
SYNTH_SDO: R8.2 ; also sheet 2
SYNTH_STAT: R1.2 ; also sheet 2
VIN_5V: FB14.P$2 J5.1(VBUS)
Unconnected: J5.4(ID) JP2.1 U7.2(PC13) U7.3(PC14) U7.4(PC15) U7.8(PC0) U7.9(PC1) U7.10(PC2) U7.11(PC3) U7.14(PA0_WKUP) U7.15(PA1) U7.24(PC4) U7.25(PC5) U7.26(PB0) U7.27(PB1) U7.28(PB2-BOOT1) U7.29(PB10) U7.30(PB11) U7.42(PA9-FS_VBUS) U7.43(PA10-FS_ID) U7.50(PA15-JTDI) U7.51(PC10) U7.52(PC11) U7.53(PC12) U7.54(PD2) U7.56(PB4-NJTRST) U7.57(PB5) U7.58(PB6) U7.59(PB7) U7.61(PB8) U7.62(PB9)

### Notes on the sheet
- SWD | DFU Program Enable
- USB Mini-B
- t.elliott
- t.elliott
- Dual Antenna
- HF/VHF/UHF Tuner, 914.5 MHz IF, 1 MHz BW

## Sheet 4 of 4
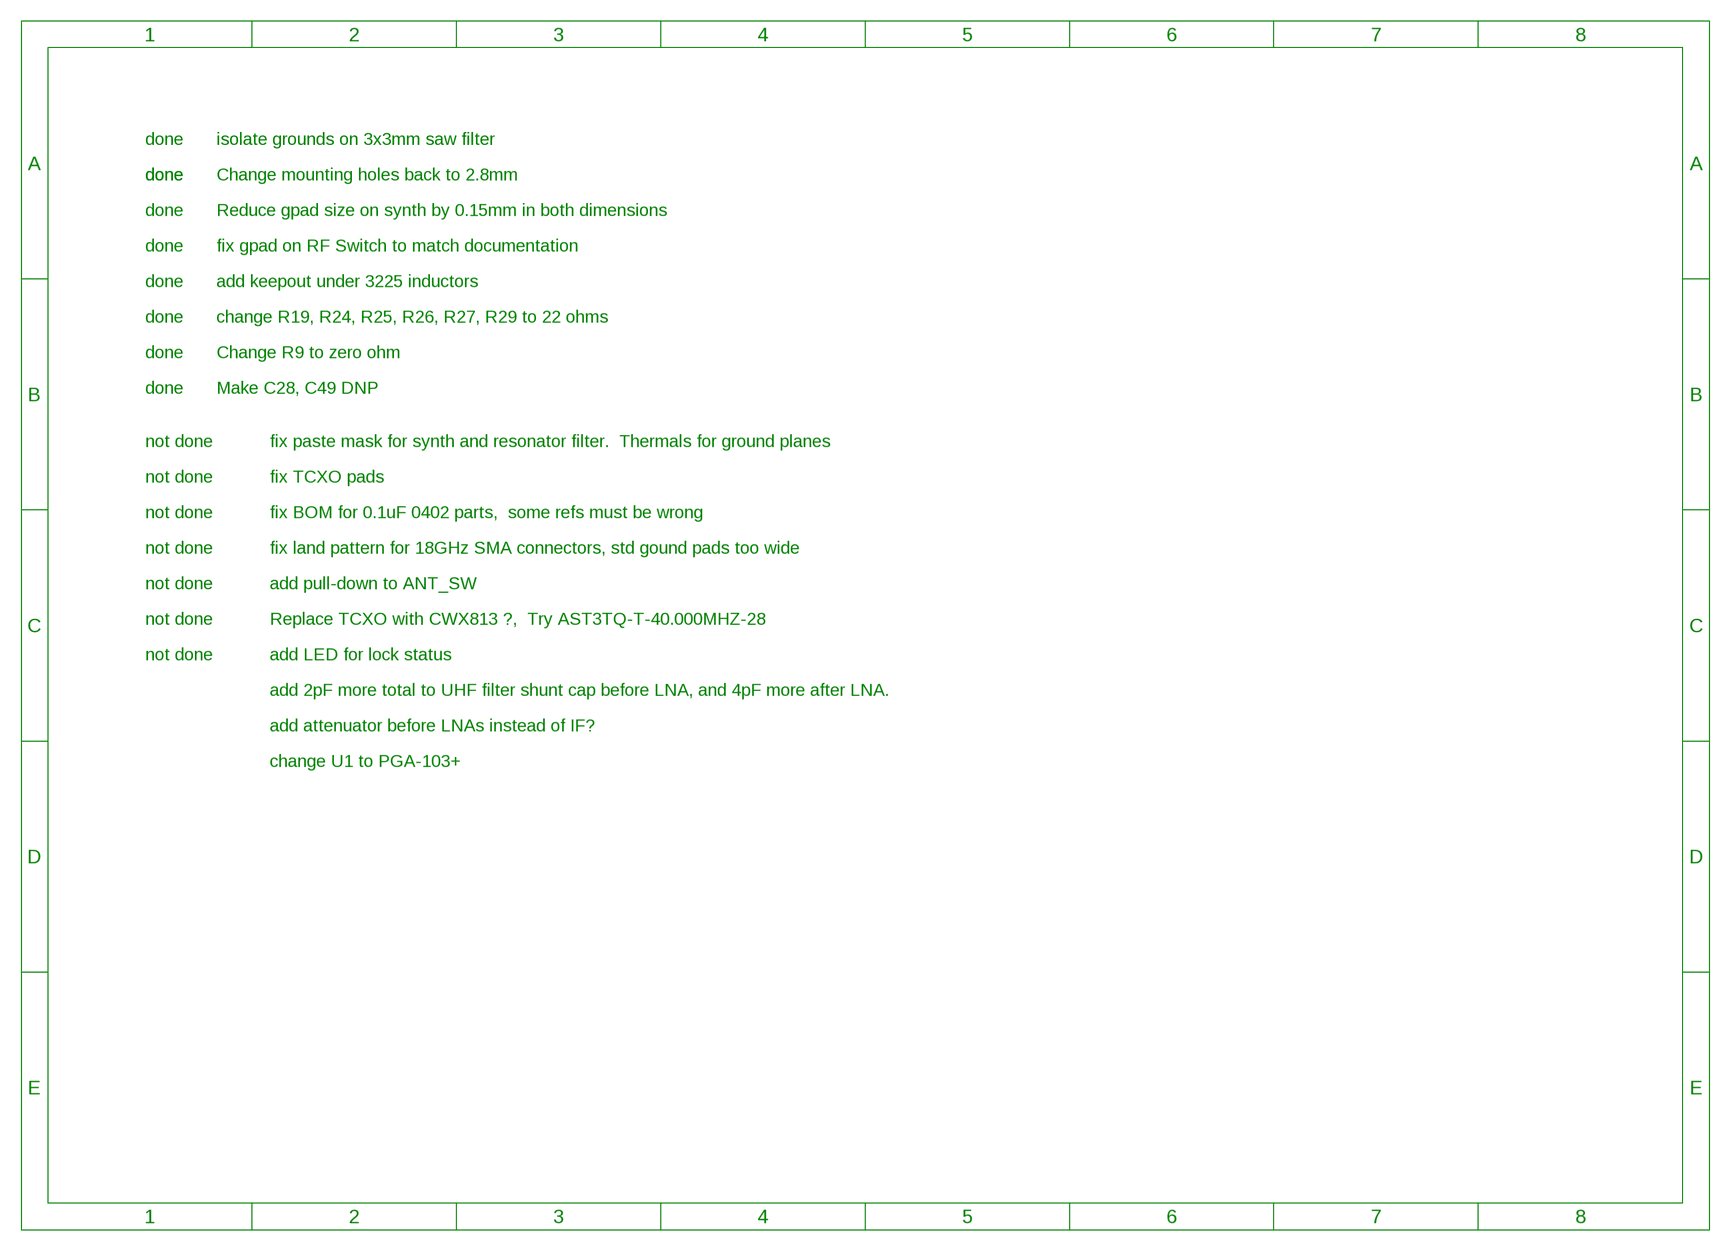
[diagram p7: schematic, sheet 4]

### Notes on the sheet
- done | isolate grounds on 3x3mm saw filter
- done | done | Change mounting holes back to 2.8mm
- done | Reduce gpad size on synth by 0.15mm in both dimensions
- done | fix gpad on RF Switch to match documentation
- done | add keepout under 3225 inductors
- done | change R19, R24, R25, R26, R27, R29 to 22 ohms
- done | Change R9 to zero ohm
- done | Make C28, C49 DNP
- not done | fix paste mask for synth and resonator filter.  Thermals for ground planes
- not done | fix TCXO pads
- not done | fix BOM for 0.1uF 0402 parts,  some refs must be wrong
- not done | fix land pattern for 18GHz SMA connectors, std gound pads too wide
- not done | add pull-down to ANT_SW
- not done | Replace TCXO with CWX813 ?,  Try AST3TQ-T-40.000MHZ-28
- not done | add LED for lock status
- add 2pF more total to UHF filter shunt cap before LNA, and 4pF more after LNA.
- add attenuator before LNAs instead of IF?
- change U1 to PGA-103+

## Power pins joined to a net without a drawn wire
GND: U9.4(GND)

## Library data of the parts
BAL1 = tdk:BALUN_TDK_HHM1522B1
C1-C86 C88 C90-C96 = m64library:C-US: CAPACITOR, American symbol
C87 C89 = nelson_vrs:CAPACITOR
D1 D3-D5 = 195_est_library:SMP1321-079LF
FAB1-FAB5 = rf_shield_pn_2118724:RF_SHIELD_PN_2118724
FB14 = api_delevan_ferrite:SMB2.5
FID1-FID4 = misclib2:FIDUCIAL
FLT1 = sawfilter:SAW
FLT2 = murata_saw:SF2049E
H1-H4 = holes:MOUNT-PAD-ROUND: MOUNTING PAD, round
J1 J2 J4 = m64library:SMA
J3 J6 = amp_ufl:AMPHENOL_A-1JB
J5 = 195Ec_300-0004-01_rev1_b:1734035-2
JP1 = pinhead:PINHD-1X10: PIN HEADER
JP2 = pinhead:PINHD-1X6: PIN HEADER
JP3 = pinhead:PINHD-1X2: PIN HEADER
JP4 = pinhead:PINHD-2X5: PIN HEADER
L1 L2 L7 L8 L13 L16-L19 L21 L22 L25 L28 L30 L31 = rcl:L-US: INDUCTOR, American symbol; PARTNUMBER: ELJ-PA331KF
L3-L6 L9-L12 L23 L24 L26 L29 = rcl:COILCRAFT_0806SQ-16N
L14 L15 L20 L27 = tcch-80+:TCCH-80+
R1 R4 R6-R8 R12 R15 R19 R24-R29 = m64library:R-US_: RESISTOR, American symbol
R2 R16 = resistor:R-US_: RESISTOR, American symbol
R3 R9-R11 R17 R18 R20-R23 = misc9:R-US_: RESISTOR, American symbol
R5 R13 R14 R37-R43 = nelson_vrs:RESISTOR
U1-U3 U6 = rfmd_sot89:PGA-103+
U4 = pe4245:PE4245
U5 = ltc6948_synth:LTC6948
U7 = 195Ec_300-0004-01_rev1_b:STM32_STM32F40X_LQFP64
U8 = minicircuits:SYM-18H
U9 = linear-technology:LT1129CST5: VOLTAGE REGULATOR with shutdown; MPN: LT1129CST-5#PBF; OC_FARNELL: 1663375; OC_NEWARK: 57M2069
U11 = 74xx-us:74*04: Hex INVERTER
X1 = connor_winfield:CWX813-020.0M
X2 = 195Ec_300-0004-01_rev1_b:ECS_CRYSTAL_ECS-250-20-30B-DU

## Net classes
1 differential: width 0.127 mm, clearance 0.127 mm